# EasyEDA schematic SCH_Line Following Robot PCB_2023-12-15.json
TITLE: Line Following Robot; REV: 1.0; Date: 2023-10-19; Sheet: 1/1; Drawn By: Simon Raman; Company: HOGENT
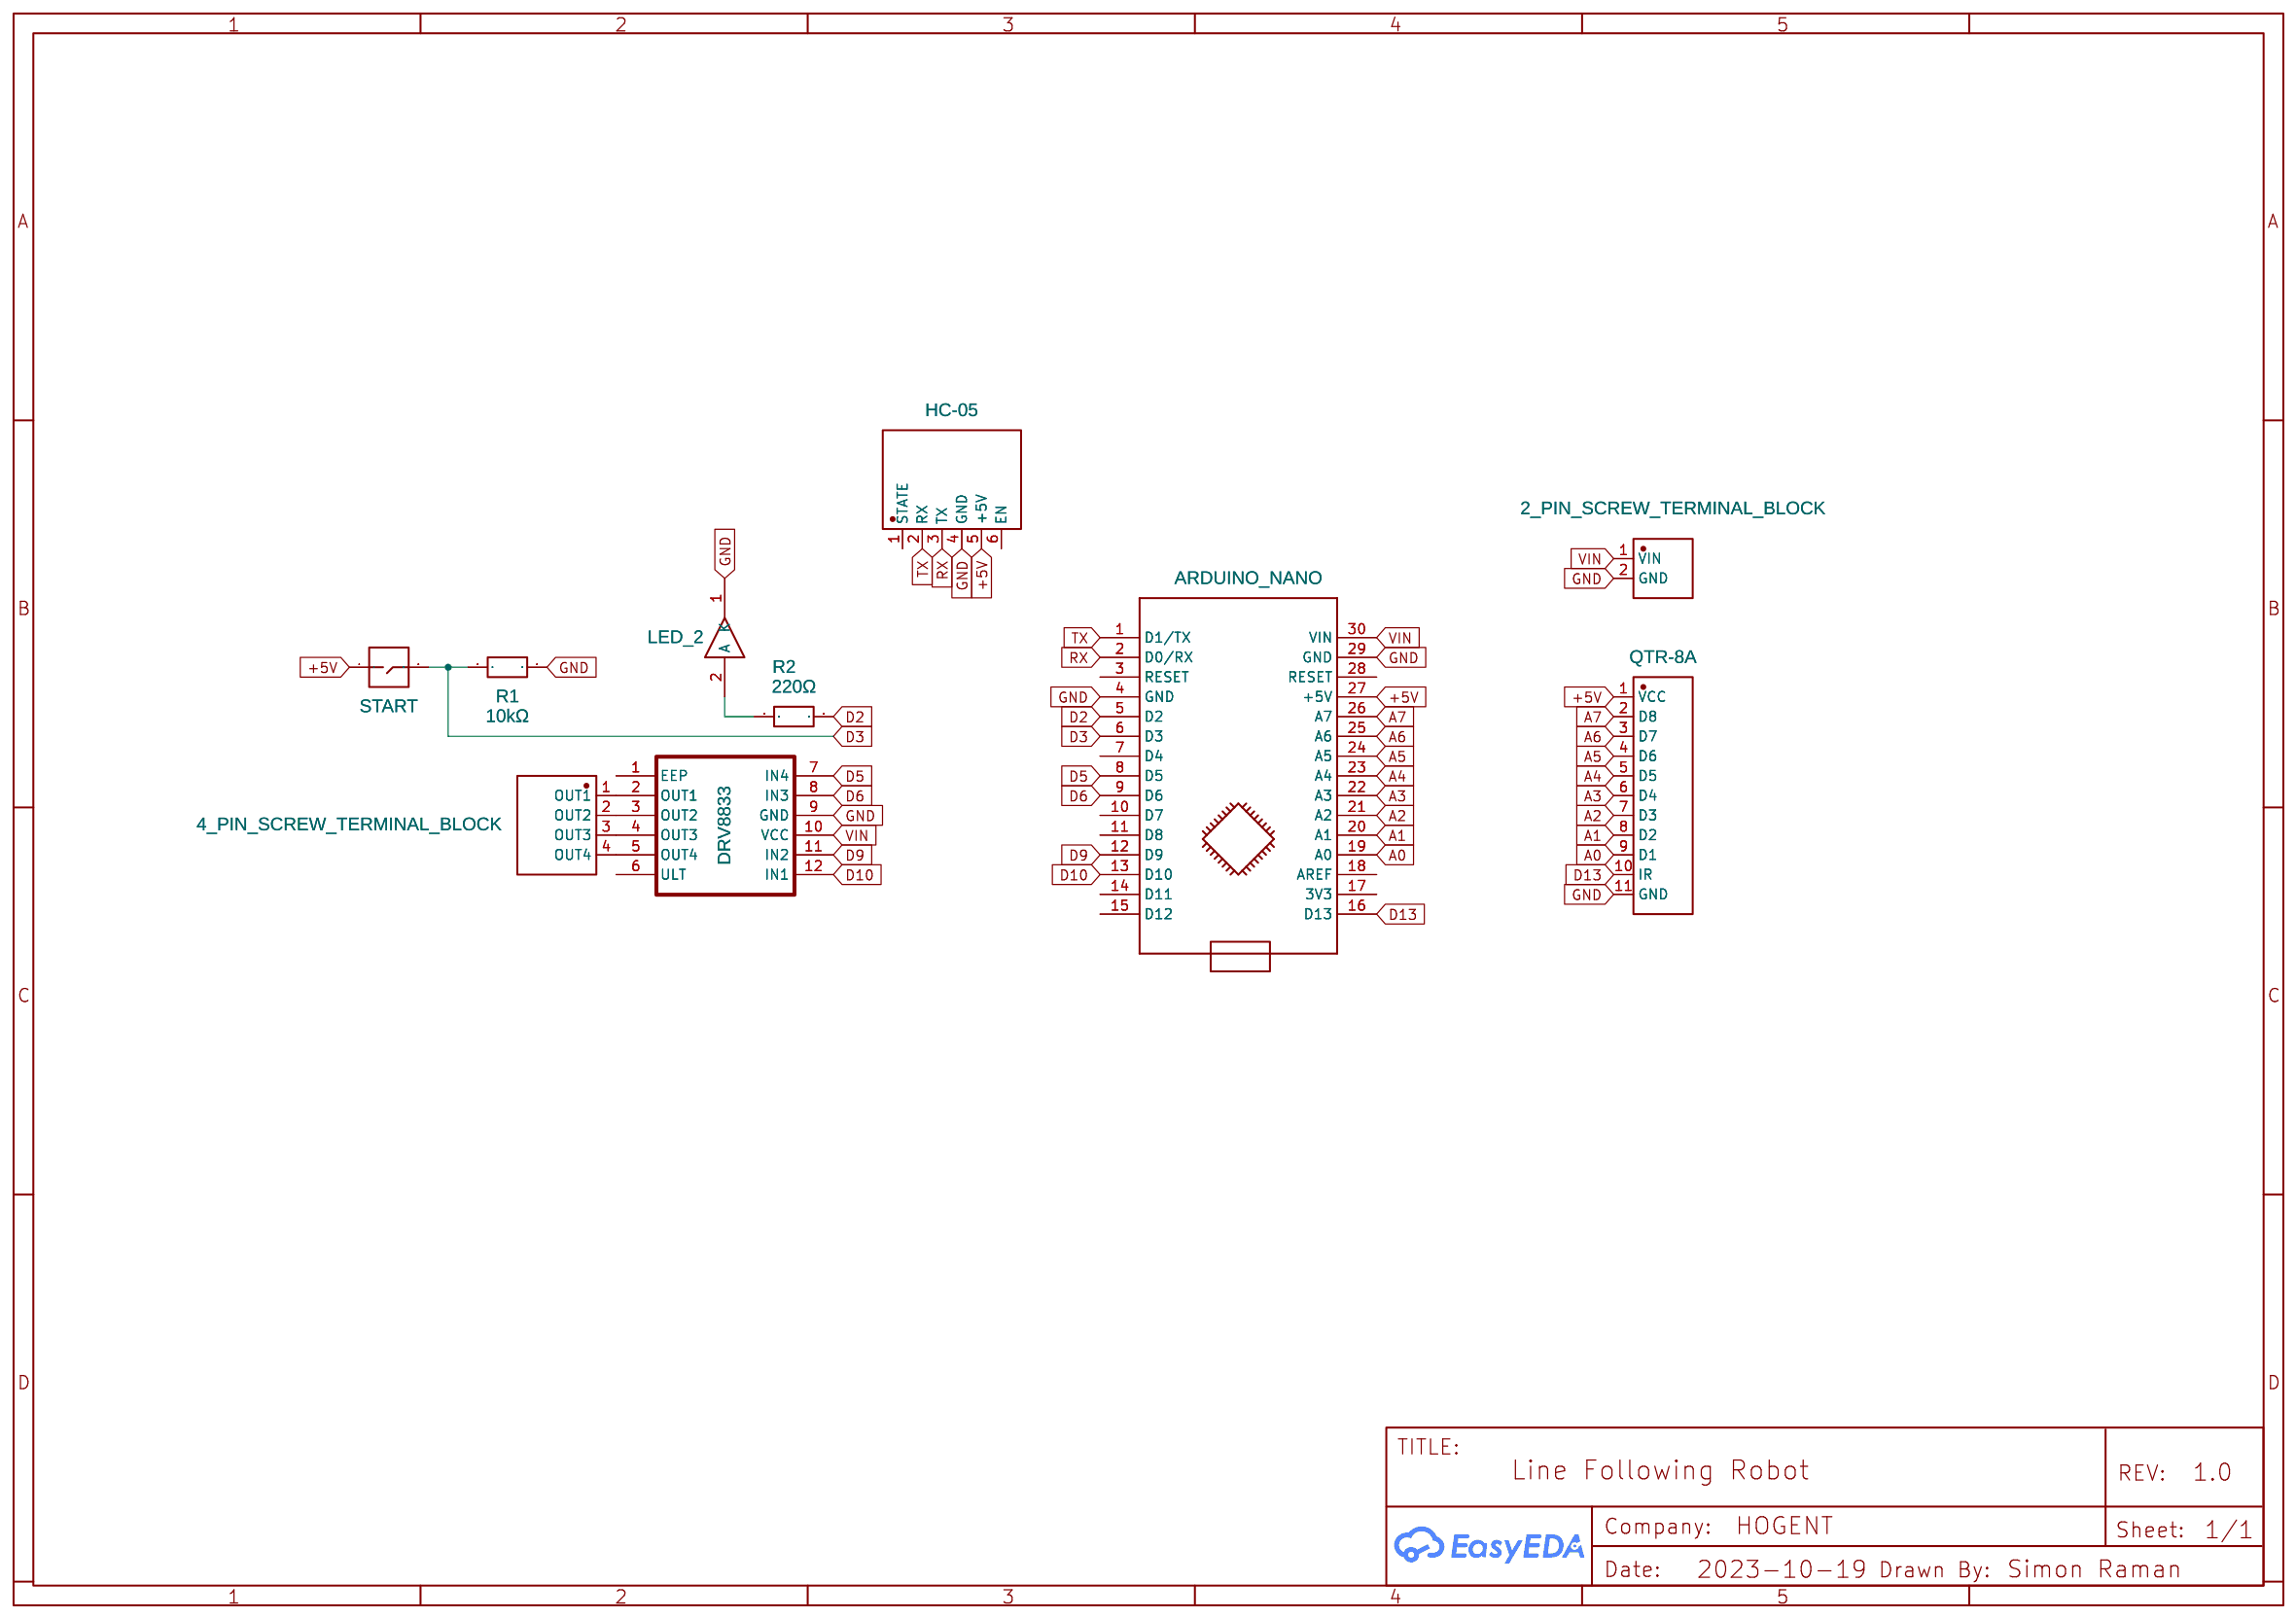
[diagram p0: schematic sheet]

## Parts
2_PIN_SCREW_TERMINAL_BLOCK  2 Pin Screw Terminal Block Connector 2.54 mm  [2 PIN SCREW TERMINAL BLOCK CONNECTOR 2.54 MM]
4_PIN_SCREW_TERMINAL_BLOCK  4 PIN SCREW TERMINAL BLOCK CONNECTOR 2.54 MM  [4 PIN SCREW TERMINAL BLOCK CONNECTOR 2.54 MM]
ARDUINO_NANO  ARDUINO NANO CLOCK  [ARDUINO-NANO]
DRV8833  DRV8833  [DRV8833 (NO ORIGINAL)]
HC-05  HC-05  [HC-05]
LED_2  led 5 mm  [FOOTPRINT_LED_5MM]
QTR-8A  QTR-8A  [QTR-8A]
R1  10kΩ  [AXIAL RESISTOR 220 OHM - TH_BD2.3-L6.0-P10.00-D0.4]
R2  220Ω  [AXIAL RESISTOR 220 OHM - TH_BD2.3-L6.0-P10.00-D0.4]
START  start  [PUSHBUTTON]

## Library data of the parts
2_PIN_SCREW_TERMINAL_BLOCK = 2 PIN SCREW TERMINAL BLOCK CONNECTOR 2.54 MM: Contributor: simonraman
4_PIN_SCREW_TERMINAL_BLOCK = 4 PIN SCREW TERMINAL BLOCK CONNECTOR 2.54 MM: Contributor: simonraman
ARDUINO_NANO = ARDUINO NANO CLOCK: Manufacturer Part: Arduino-NANO; Supplier Part: undefined; Contributor: alancilia
DRV8833 = DRV8833 12PIN: Contributor: PiterSantaCruz
HC-05 = HC-05: Contributor: simonraman
LED_2 = led 5 mm: Contributor: umar_Eldikon
QTR-8A = QTR-8A: Contributor: simonraman
R1 R2 = AXIAL RESISTOR 220 OHM - TH_BD2.3-L6.0-P10.00-D0.4: Contributor: Waleed Kies; JLCPCB Part Class: Extended Part
START = Push Button: Contributor: Ahmed Elgendy

## Nets
+5V: ARDUINO_NANO.27(+5V) HC-05.5(+5V) QTR-8A.1(VCC) START.1
GND: 2_PIN_SCREW_TERMINAL_BLOCK.2(GND) ARDUINO_NANO.4(GND) ARDUINO_NANO.29(GND) DRV8833.9(GND) HC-05.4(GND) LED_2.1(K) QTR-8A.11(GND) R1.1
VIN: 2_PIN_SCREW_TERMINAL_BLOCK.1(VIN) ARDUINO_NANO.30(VIN) DRV8833.10(VCC)
A0: ARDUINO_NANO.19(A0) QTR-8A.9(D1)
A1: ARDUINO_NANO.20(A1) QTR-8A.8(D2)
A2: ARDUINO_NANO.21(A2) QTR-8A.7(D3)
A3: ARDUINO_NANO.22(A3) QTR-8A.6(D4)
A4: ARDUINO_NANO.23(A4) QTR-8A.5(D5)
A5: ARDUINO_NANO.24(A5) QTR-8A.4(D6)
A6: ARDUINO_NANO.25(A6) QTR-8A.3(D7)
A7: ARDUINO_NANO.26(A7) QTR-8A.2(D8)
D2: ARDUINO_NANO.5(D2) R2.2
D3: ARDUINO_NANO.6(D3) R1.2 START.2
D5: ARDUINO_NANO.8(D5) DRV8833.7(IN4)
D6: ARDUINO_NANO.9(D6) DRV8833.8(IN3)
D9: ARDUINO_NANO.12(D9) DRV8833.11(IN2)
D10: ARDUINO_NANO.13(D10) DRV8833.12(IN1)
D13: ARDUINO_NANO.16(D13) QTR-8A.10(IR)
RX: ARDUINO_NANO.2(D0/RX) HC-05.3(TX)
TX: ARDUINO_NANO.1(D1/TX) HC-05.2(RX)
Net-(4_PIN_SCREW_TERMINAL_BLOCK-1): 4_PIN_SCREW_TERMINAL_BLOCK.1(OUT1) DRV8833.2(OUT1)
Net-(4_PIN_SCREW_TERMINAL_BLOCK-2): 4_PIN_SCREW_TERMINAL_BLOCK.2(OUT2) DRV8833.3(OUT2)
Net-(4_PIN_SCREW_TERMINAL_BLOCK-3): 4_PIN_SCREW_TERMINAL_BLOCK.3(OUT3) DRV8833.4(OUT3)
Net-(4_PIN_SCREW_TERMINAL_BLOCK-4): 4_PIN_SCREW_TERMINAL_BLOCK.4(OUT4) DRV8833.5(OUT4)
Net-(LED_2-2): LED_2.2(A) R2.1

Not connected (* = marked no-connect by the designer): ARDUINO_NANO 3(RESET) 7(D4) 10(D7) 11(D8) 14(D11) 15(D12) 17(3V3) 18(AREF) 28(RESET); DRV8833 1(EEP) 6(ULT); HC-05 1(STATE) 6(EN)
